# Altium schematic sheet 1Wire.SchDoc
size A4
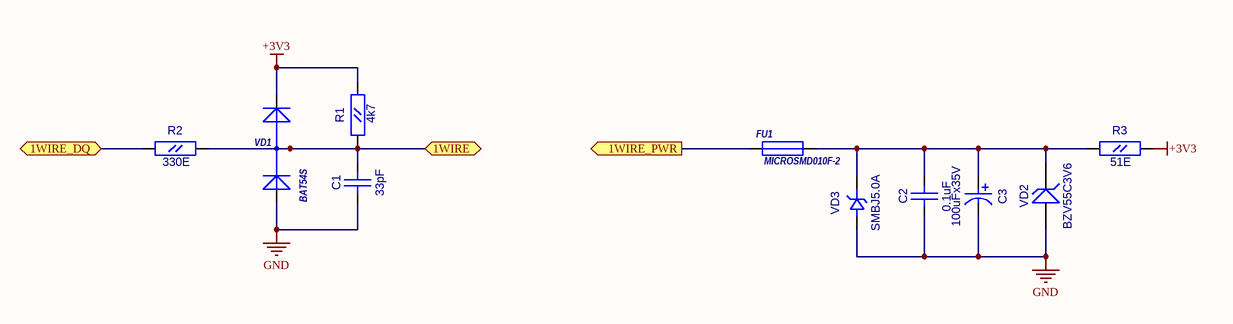
[diagram p0: 1Wire.SchDoc]

## Parts
C1  33pF  [CC0603]
C2  0.1uF  [CC0603]
C3  100uFx35V  [CC20X2.54]
FU1  MICROSMD010F-2  [RC1210]
R1  4k7  [RC0603]
R2  330E  [RC0603]
R3  51E  [RC0603]
VD1  BAT54S  [SOT-23(GSD)]
VD2  BZV55C3V6  [SOD-80]
VD3  SMBJ5.0A  [SMB]

## Ports
1WIRE (bidir), 1WIRE_DQ (bidir), 1WIRE_PWR (out)

## Nets
+3V3: R1.2(B) R3.2(B) VD1.2(K)
GND: C1.1(A) C2.1(A) C3.2(minus) VD1.1(A) VD2.1(A) VD3.1(A)
1WIRE: C1.2(B) R1.1(A) R2.2(B) VD1.3(AK) ; port 1WIRE
1WIRE_DQ: R2.1(A) ; port 1WIRE_DQ
1WIRE_PWR: FU1.1 ; port 1WIRE_PWR
NetC2_2: C2.2(B) C3.1(plus) FU1.2 R3.1(A) VD2.2 VD3.2(K)

## Library data of the parts
C1 C2 = CC0603
  C1: Value: 33pF
  C2: Value: 0.1uF
C3 = CAP0.25: Value: 100uFx35V
FU1 = MICROSMD: Value: MICROSMD010F-2
R1-R3 = RC0603
  R1: Value: 4k7
  R2: Value: 330E
  R3: Value: 51E
VD1 = BAT54S: 1.0 Ampere General Purpose Rectifier; ComponentField6: Published 8-Jun-2000, Modified 11-July-2000: SIM Model Added.; Value: *
VD2 = BZV55C5V1: Zener Voltage Regulator Diode; OriginalName: BZX84C10LT1; ComponentField6: Pin 2 is not connected and not drawn.; ComponentField7: Published 29-Sep-2000; Value: BZV55C3V6
VD3 = SMBJ: Value: SMBJ5.0A